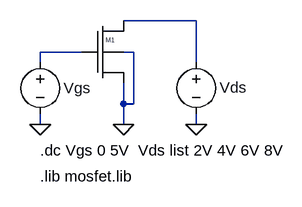
[diagram p0: schematic mos-transfer.asc]
mos-transfer.asc, the LTspice schematic file:
Version 4
SHEET 1 1292 680
WIRE -608 -32 -720 -32
WIRE -784 16 -848 16
WIRE -704 16 -720 16
WIRE -848 32 -848 16
WIRE -608 32 -608 -32
WIRE -720 96 -720 64
WIRE -704 96 -704 16
WIRE -704 96 -720 96
WIRE -848 128 -848 112
WIRE -720 128 -720 96
WIRE -608 128 -608 112
FLAG -608 128 0
FLAG -848 128 0
FLAG -720 128 0
SYMBOL voltage -608 16 R0
WINDOW 123 0 0 Left 2
WINDOW 39 37 60 Left 2
WINDOW 0 36 55 Left 2
WINDOW 3 37 60 Left 2
SYMATTR InstName Vds
SYMATTR Value ""
SYMBOL voltage -848 16 R0
WINDOW 123 0 0 Left 2
WINDOW 39 40 53 Left 2
WINDOW 3 40 69 Left 2
WINDOW 0 36 56 Left 2
SYMATTR Value ""
SYMATTR InstName Vgs
SYMBOL nmos -768 -32 R0
SYMATTR InstName M1
SYMATTR SpiceModel ""
SYMATTR Value N_1u
SYMATTR Value2 l=1u w=12u
TEXT -848 168 Left 2 !.dc Vgs 0 5V  Vds list 2V 4V 6V 8V
TEXT -848 208 Left 2 !.lib mosfet.lib

The netlist it stands for:
* mos-transfer.asc
Vds N001 0
Vgs N002 0
M1 N001 N002 0 0 N_1u l=1u w=12u
.model NMOS NMOS
.model PMOS PMOS
.lib standard.mos
.dc Vgs 0 5V  Vds list 2V 4V 6V 8V
.lib mosfet.lib
.backanno
.end